# EasyEDA Pro project BLDC_DriverV4.eprj

# Schematic Schematic1_1
Create Date: 2024-09-20; Page Name: P1; Project Name: PCBPhase; Schematic Name: Schematic1; Update Date: 2024-09-20; Company: EasyEDA.com; Drawn: EasyEDA; Page Size: A4; Part Number: JLCPCB-002; Reviewed: EasyEDA; Version: V0.1
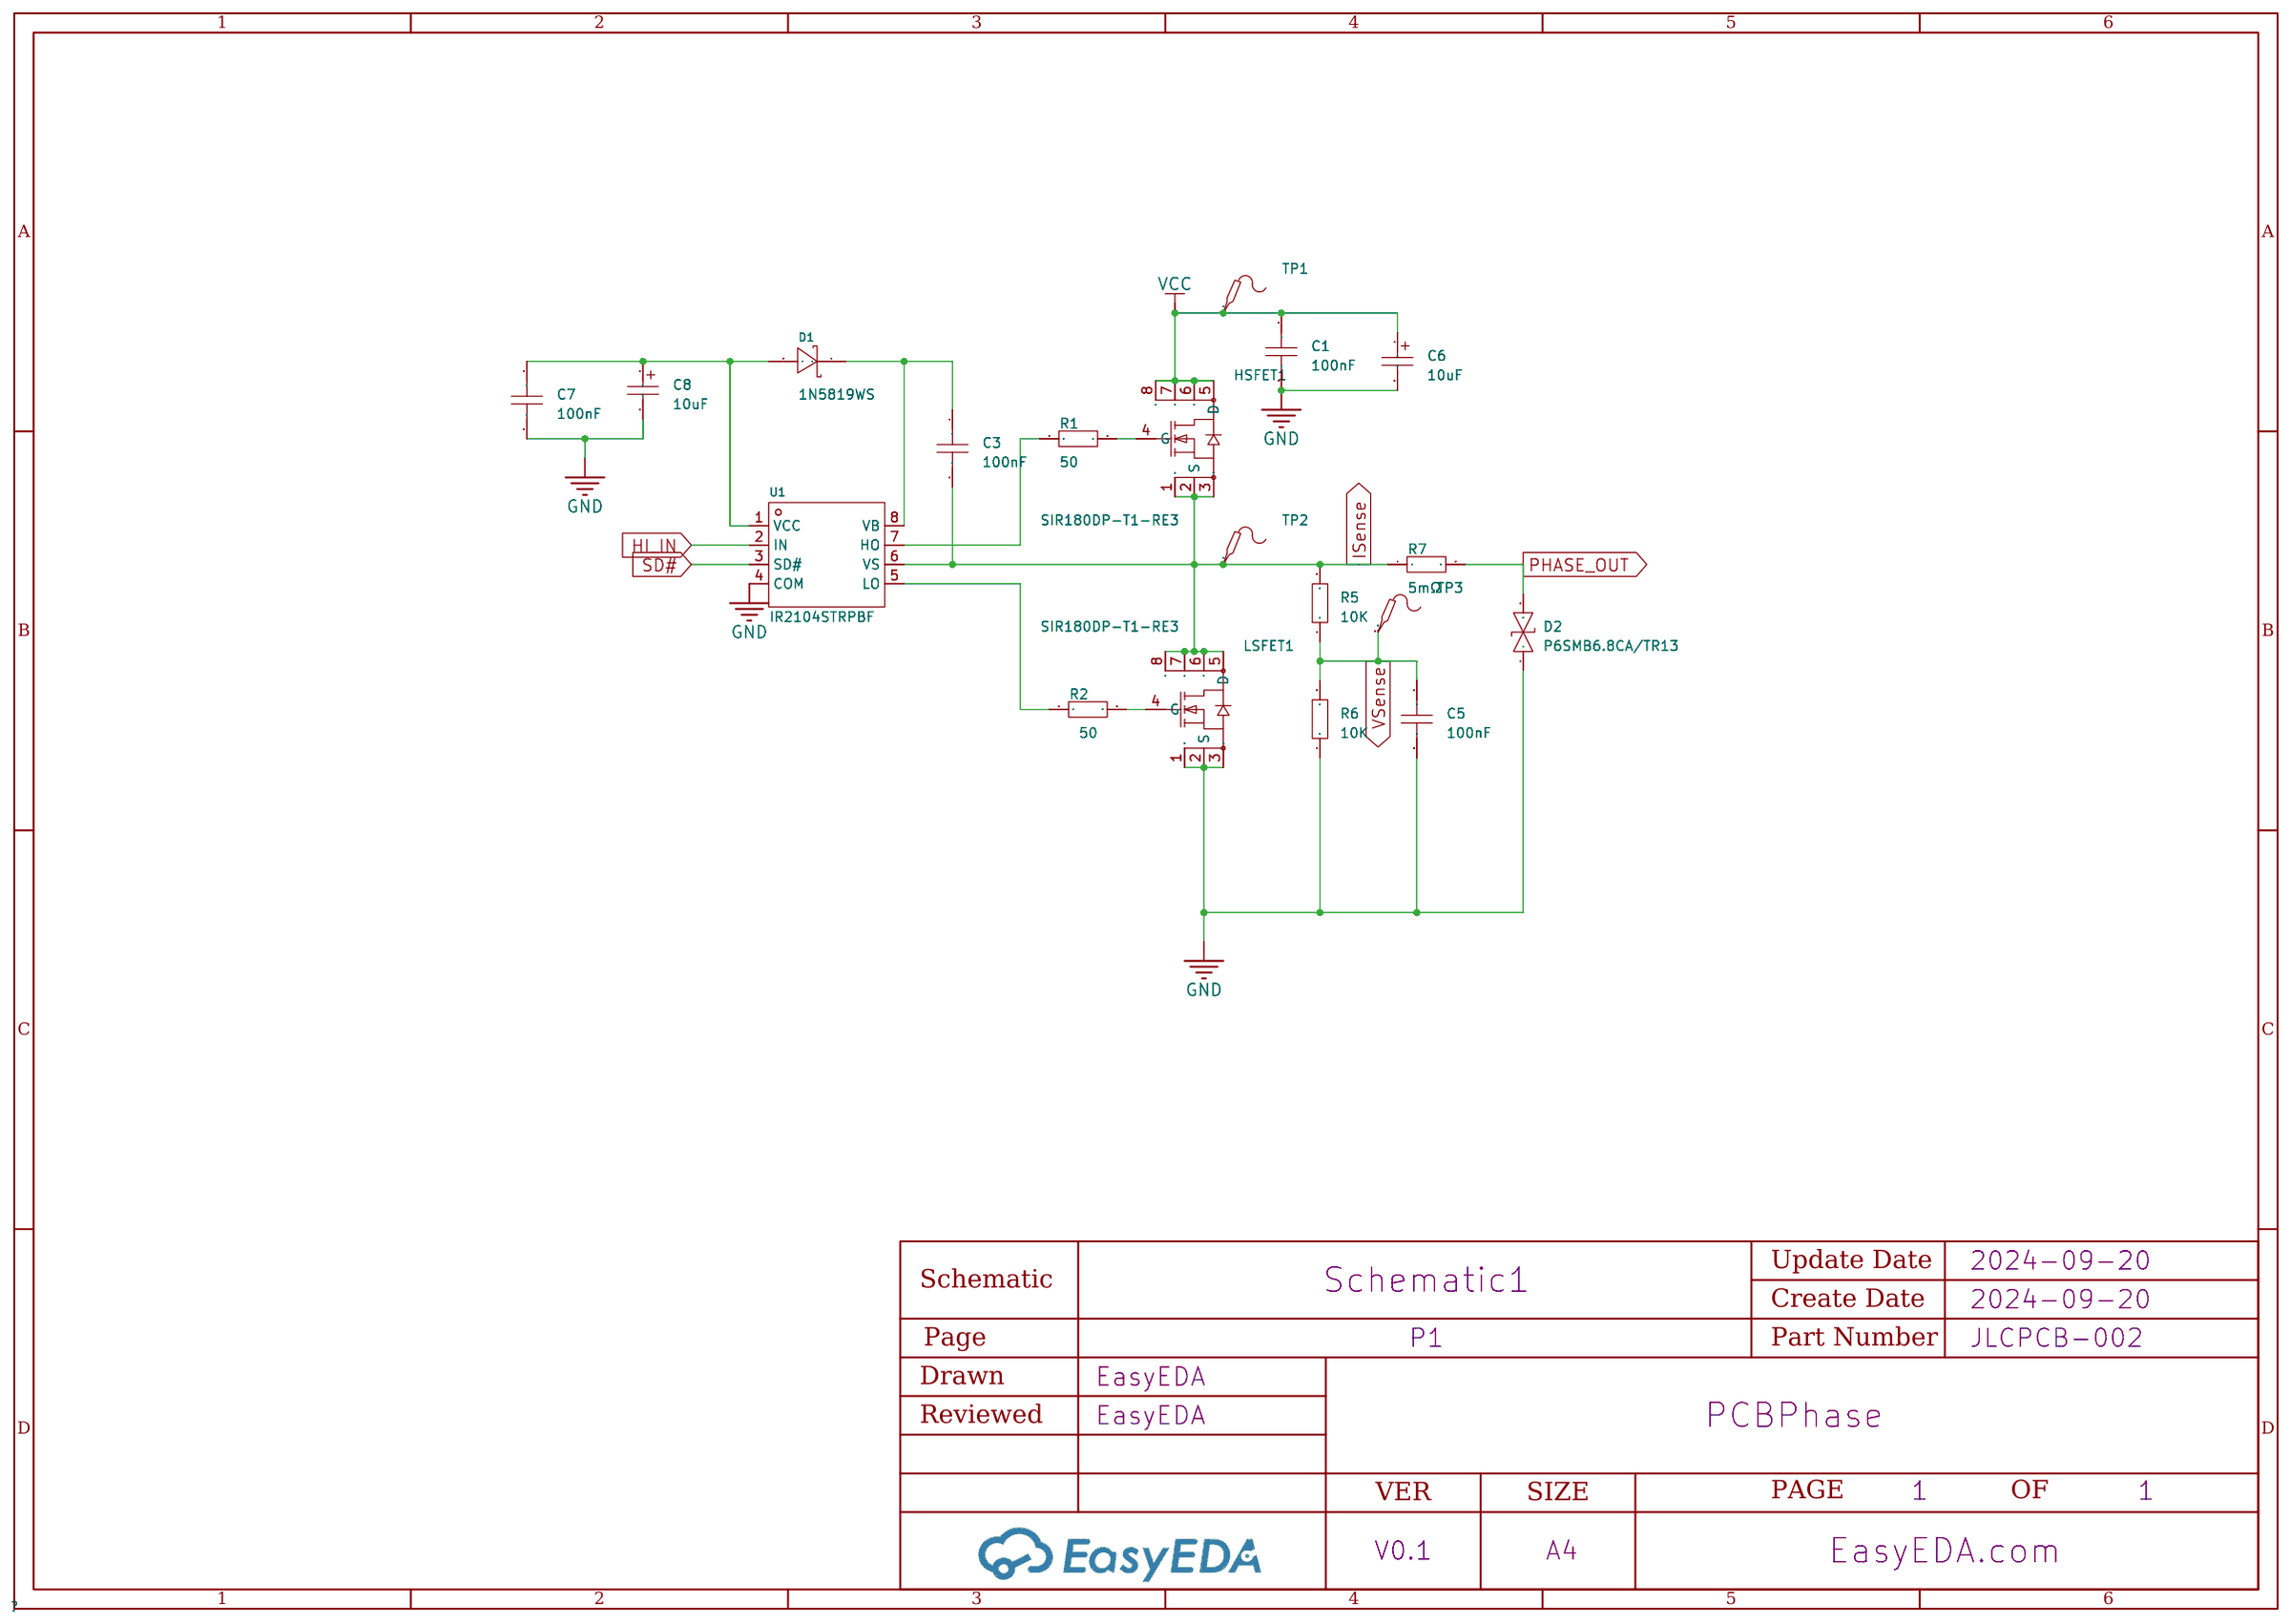
[diagram p0: schematic sheet]

## Parts
C1  100nF  [C0603]
C3  100nF  [C0603]
C5  100nF  [C0603]
C6  10uF  [CAP-SMD_BD3.0-L3.3-W3.3-RD]
C7  100nF  [C0603]
C8  10uF  [CAP-SMD_BD3.0-L3.3-W3.3-RD]
D1  1N5819WS  [SOD-323_L1.8-W1.3-LS2.5-RD]
D2  P6SMB6.8CA/TR13  [SMB_L4.6-W3.6-LS5.3-BI]
HSFET1  SIR180DP-T1-RE3  [POWERPAK-SO-8_L5.9-W4.9-P1.27-LS6.2-BL]
LSFET1  SIR180DP-T1-RE3  [POWERPAK-SO-8_L5.9-W4.9-P1.27-LS6.2-BL]
R1  50  [R0603]
R2  50  [R0603]
R5  10K  [R0603]
R6  10K  [R0603]
R7  5mΩ  [R2512]
TP1  -  [Test-Point-0.5mm]
TP2  -  [Test-Point-0.5mm]
TP3  -  [Test-Point-0.5mm]
U1  IR2104STRPBF  [SOIC-8_L4.9-W3.9-P1.27-LS6.0-BL]

## Library data of the parts
C1 C3 C5 C7 = CAP_0603: Supplier Footprint: 0603
C6 C8 = C_Ele_SMD_3x5.4mm: Supplier Footprint: SMD,3x5.4mm
D1 = 1N5819WS_C191023: Forward Voltage (Vf@If):600mV@1A Reverse Voltage (Vr):40V Average Rectified Current (Io):1A; LCSC Part Name: 电压:40V 电流:1A; Supplier Part: C191023; Manufacturer: Hottech(合科泰); Supplier Footprint: SOD-323; JLCPCB Part Class: Basic Part; Datasheet: https://atta.szlcsc.com/upload/public/pdf/source/20220428/3CB86FD8D28D653594B4E35F9D5AEFD9.pdf; Supplier: LCSC; Forward Voltage (Vf@If): 600mV@1A; Reverse Voltage (Vr): 40V; Average Rectified Current (Io): 1A
D2 = P6SMB6.8CA/TR13: Reverse Stand-Off Voltage (Vrwm):5.8V Maximum Clamping Voltage:10.5V Peak Pulse Current (Ipp)@10/1000us:58.1A Peak Pulse Power Dissipation (Ppp)@10/1000us:600W Breakdown Voltage:6.45V Type:TVS; Supplier Part: C78395; Manufacturer: Brightking(君耀电子); Supplier Footprint: SMB(DO-214AA); JLCPCB Part Class: Basic Part; Datasheet: https://atta.szlcsc.com/upload/public/pdf/source/20160709/1468031879762.pdf; Supplier: LCSC; Reverse Stand-Off Voltage (Vrwm): 5.8V; Maximum Clamping Voltage: 10.5V; Peak Pulse Current (Ipp)@10/1000us: 58.1A; Peak Pulse Power Dissipation (Ppp)@10/1000us: 600W; Breakdown Voltage: 6.45V; Type: TVS
HSFET1 LSFET1 = SIR180DP-T1-RE3: Type:1个NChannel Drain Source Voltage (Vdss):60V Continuous Drain Current (Id):；32.4A Power Dissipation (Pd):； Drain Source On Resistance (RDS(on)@Vgs,Id):2.05mΩ@10A,10V Gate Threshold Voltage (Vgs(th)@Id):3.6V@250uA Total Gate Charge (Qg@Vgs):87nC@10V Inp; LCSC Part Name: 1个N沟道 耐压:60V 电流:60A 电流:32.4A; Supplier Part: C5334421; Manufacturer: VISHAY(威世); Supplier Footprint: SO-8; JLCPCB Part Class: Extended Part; Datasheet: https://atta.szlcsc.com/upload/public/pdf/source/20221230/5EAF42ED79532020A551540FC13481A3.pdf; Supplier: LCSC; Type: 1个NChannel; Drain Source Voltage (Vdss): 60V; Continuous Drain Current (Id): ；32.4A; Power Dissipation (Pd): ；; Drain Source On Resistance (RDS(on)@Vgs,Id): 2.05mΩ@10A,10V; Gate Threshold Voltage (Vgs(th)@Id): 3.6V@250uA; Total Gate Charge (Qg@Vgs): 87nC@10V; Input Capacitance (Ciss@Vds): 4.03nF@30V; Operating Temperature: -55℃~+150℃@(Tj)
R1 R2 R5 R6 = Res_0603: Supplier Footprint: 0603
R7 = PA2512FKF7W0R005E: Type:Current Sensing Resistors Resistance: Tolerance:±1% Tolerance:±1% Power(Watts): Temperature Coefficient:±100ppm/℃ Temperature Coefficient:±100ppm/℃; LCSC Part Name: 5mΩ ±1% 2W; Supplier Part: C309526; Manufacturer: YAGEO(国巨); Supplier Footprint: 2512; JLCPCB Part Class: Extended Part; Datasheet: https://atta.szlcsc.com/upload/public/pdf/source/20190227/C375693_219964CC8B3EBD36DBDF701587FA5938.pdf; Supplier: LCSC; Type: Current Sensing Resistors; Tolerance: ±1%; Temperature Coefficient: ±100ppm/℃
TP1-TP3 = Test-Point: Test Point 测试点
U1 = IR2104STRPBF: Driven Configuration:Half Bridge Load Type:MOSFET；IGBT Number of Drivers:2 Peak Output Current(sink):360mA Peak Output Current(source):210mA Supply Voltage:10V~20V Supply Voltage:10V~20V Rise Time:100ns Fall Time:50ns Operating Temperature:-40℃~+150℃@(Tj); Supplier Part: C2960; Manufacturer: Infineon(英飞凌); Supplier Footprint: SOIC-8; JLCPCB Part Class: Extended Part; Datasheet: https://atta.szlcsc.com/upload/public/pdf/source/20140906/1457707236579.pdf; Supplier: LCSC; Driven Configuration: Half Bridge; Load Type: MOSFET；IGBT; Number of Drivers: 2; Peak Output Current(sink): 360mA; Peak Output Current(source): 210mA; Supply Voltage: 10V~20V; Rise Time: 100ns; Fall Time: 50ns; Operating Temperature: -40℃~+150℃@(Tj)

## Nets
GND: C1.2 C5.2 C6.2 C7.2 C8.2 D2.1 LSFET1.1(S) LSFET1.2(S) LSFET1.3(S) R6.1 U1.4(COM)
VCC: C1.1 C6.1 HSFET1.5(D) HSFET1.6(D) HSFET1.7(D) HSFET1.8(D) TP1.1
HI_IN: U1.2(IN)
ISense: C3.2 HSFET1.1(S) HSFET1.2(S) HSFET1.3(S) LSFET1.5(D) LSFET1.6(D) LSFET1.7(D) LSFET1.8(D) R5.2 R7.1 TP2.1 U1.6(VS)
PHASE_OUT: D2.2 R7.2
SD#: U1.3(SD#)
VSense: C5.1 R5.1 R6.2 TP3.1
$1N697: R1.1 U1.7(HO)
$1N698: HSFET1.4(G) R1.2
$1N699: R2.1 U1.5(LO)
$1N700: LSFET1.4(G) R2.2
$1N719: C3.1 D1.1(K) U1.8(VB)
$1N721: C7.1 C8.1 D1.2(A) U1.1(VCC)

# Schematic PCBPhase
Create Date: 2024-09-20; Page Name: P1; Project Name: PCBPhase; Schematic Name: PCBPhase; Update Date: 2024-09-19; Company: EasyEDA.com; Drawn: EasyEDA; Page Size: A4; Part Number: JLCPCB-002; Reviewed: EasyEDA; Version: V0.1
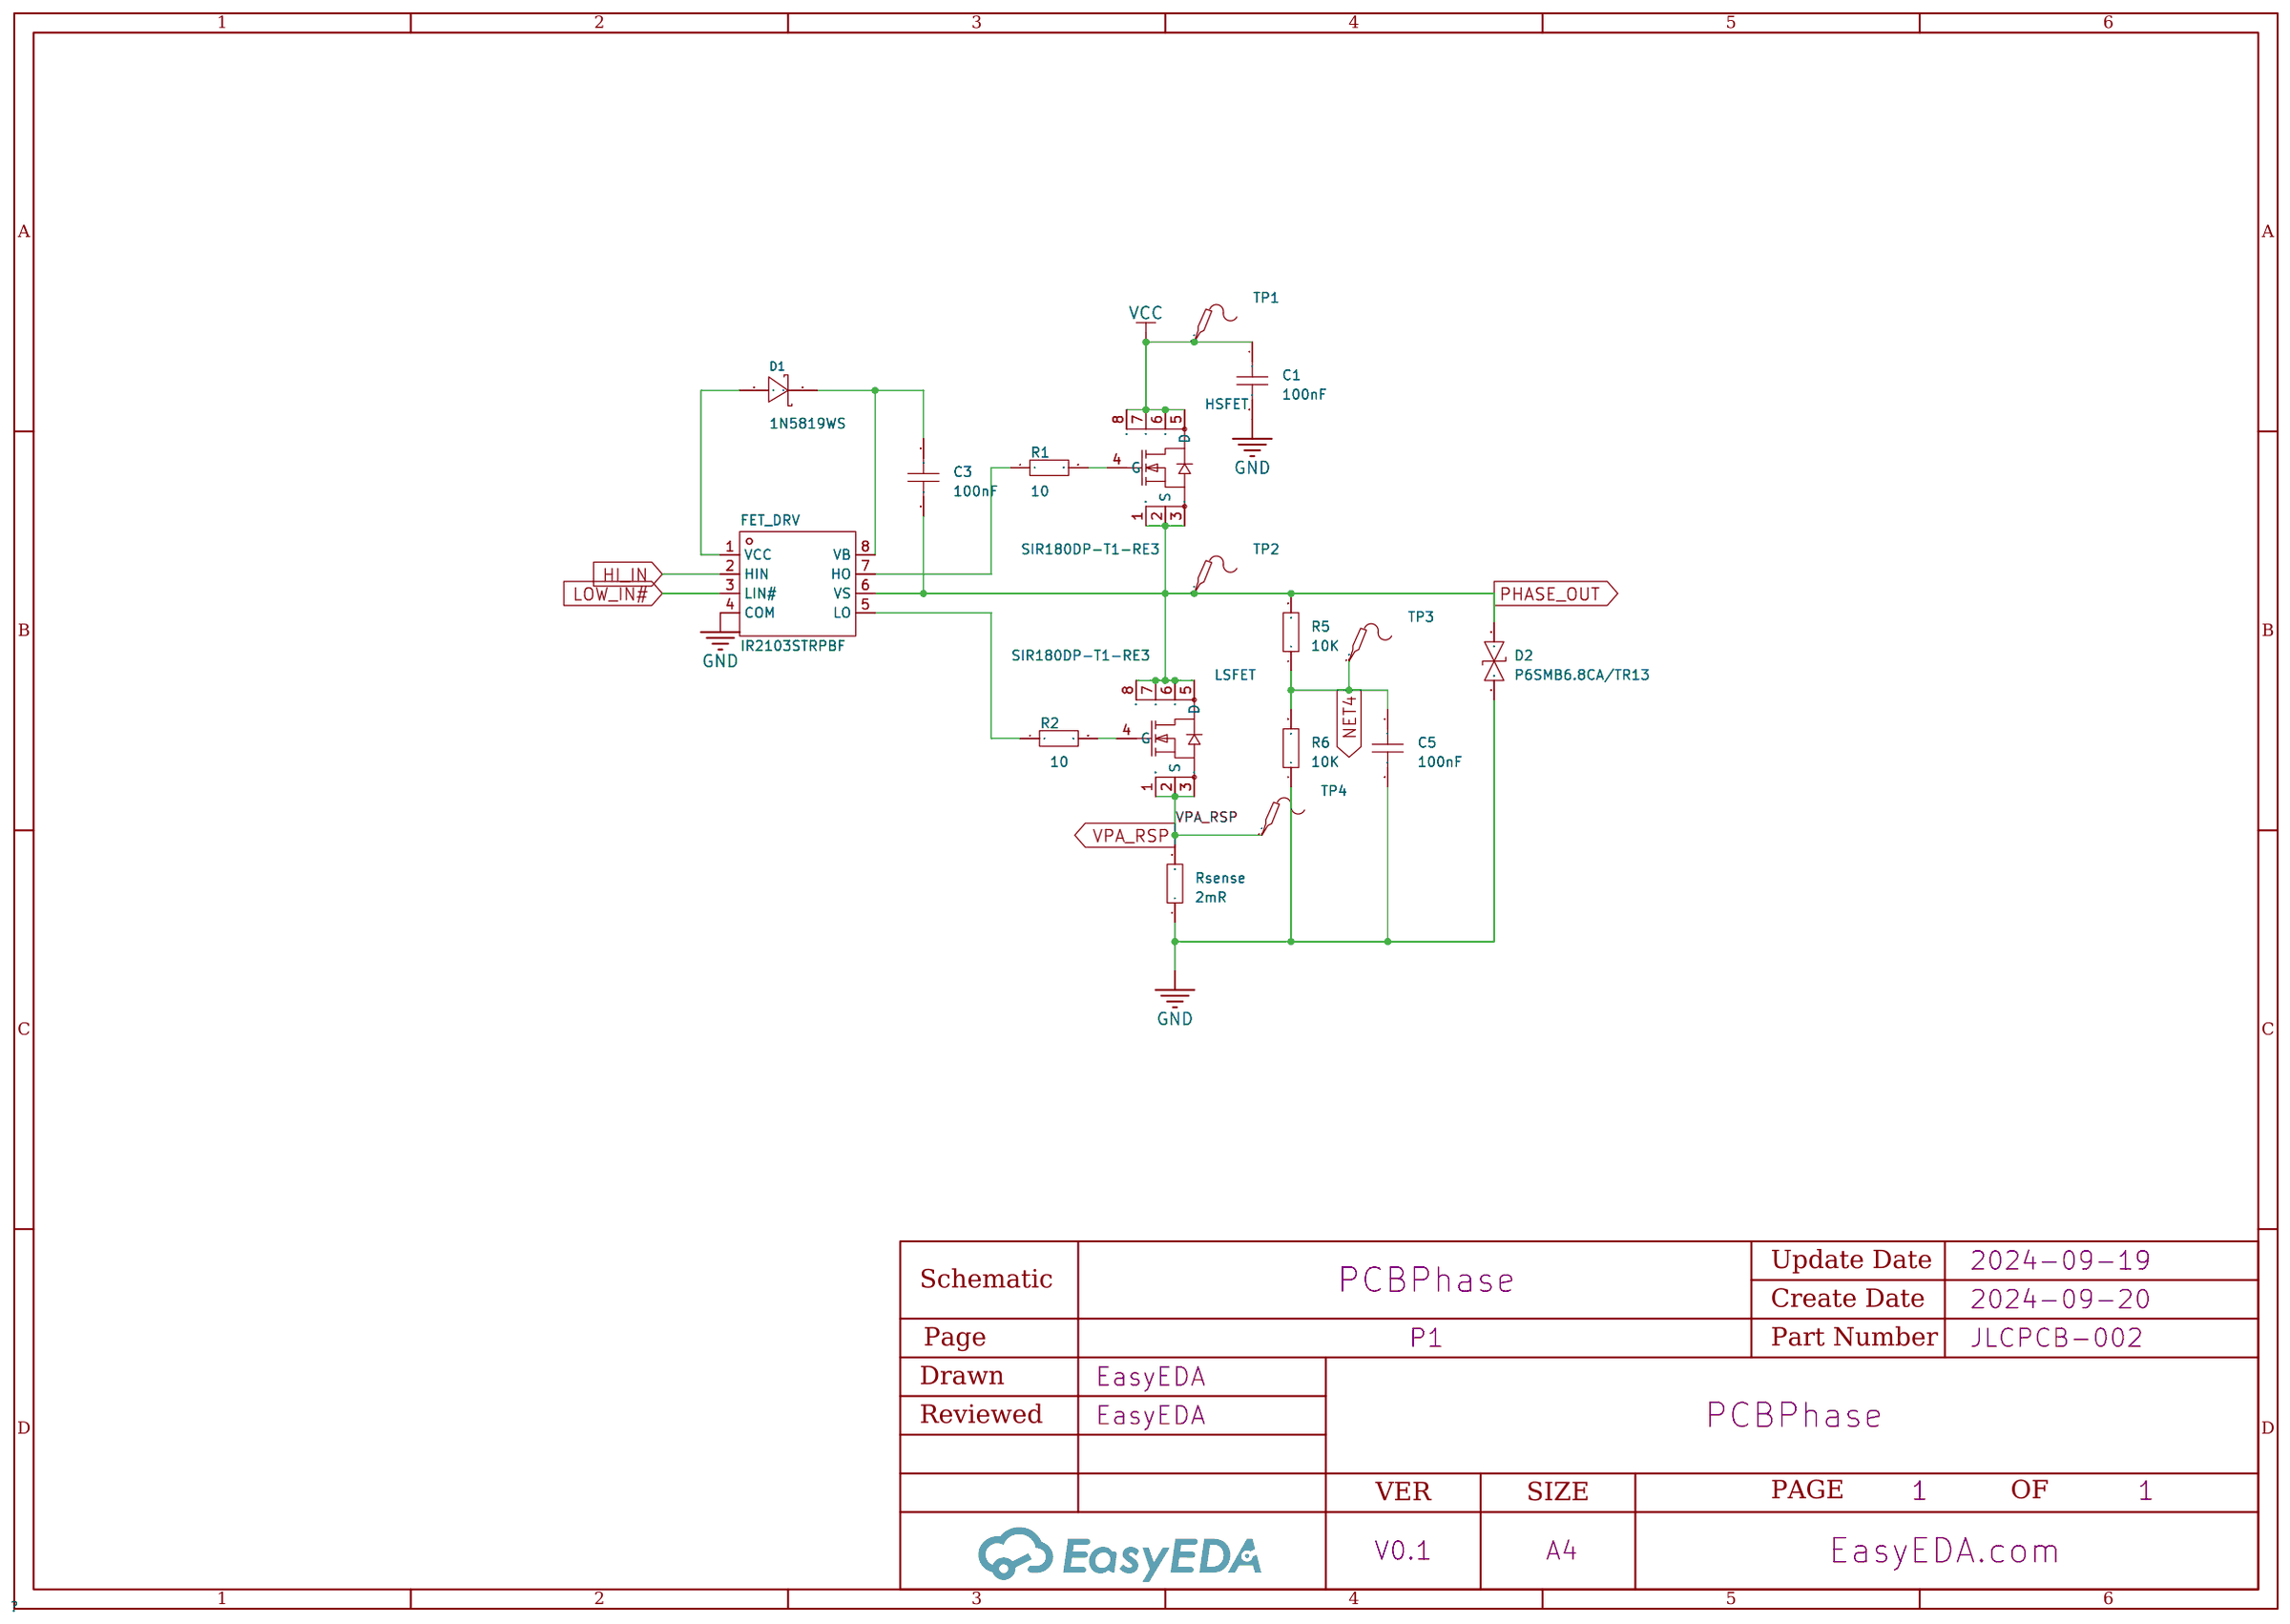
[diagram p1: schematic sheet]

## Parts
C1  100nF  [C0603]
C3  100nF  [C0603]
C5  100nF  [C0603]
D1  1N5819WS  [SOD-323_L1.8-W1.3-LS2.5-RD]
D2  P6SMB6.8CA/TR13  [SMB_L4.6-W3.6-LS5.3-BI]
FET_DRV  IR2103STRPBF  [SOIC-8_L4.9-W3.9-P1.27-LS6.0-BL]
HSFET  SIR180DP-T1-RE3  [POWERPAK-SO-8_L5.9-W4.9-P1.27-LS6.2-BL]
LSFET  SIR180DP-T1-RE3  [POWERPAK-SO-8_L5.9-W4.9-P1.27-LS6.2-BL]
R1  10  [R0603]
R2  10  [R0603]
R5  10K  [R0603]
R6  10K  [R0603]
Rsense  2mR  [R0603]
TP1  -  [Test-Point-0.5mm]
TP2  -  [Test-Point-0.5mm]
TP3  -  [Test-Point-0.5mm]
TP4  -  [Test-Point-0.5mm]

## Library data of the parts
C1 C3 C5 = CAP_0603: Supplier Footprint: 0603
D1 = 1N5819WS_C191023: Forward Voltage (Vf@If):600mV@1A Reverse Voltage (Vr):40V Average Rectified Current (Io):1A; LCSC Part Name: 电压:40V 电流:1A; Supplier Part: C191023; Manufacturer: Hottech(合科泰); Supplier Footprint: SOD-323; JLCPCB Part Class: Basic Part; Datasheet: https://atta.szlcsc.com/upload/public/pdf/source/20220428/3CB86FD8D28D653594B4E35F9D5AEFD9.pdf; Supplier: LCSC; Forward Voltage (Vf@If): 600mV@1A; Reverse Voltage (Vr): 40V; Average Rectified Current (Io): 1A
D2 = P6SMB6.8CA/TR13: Reverse Stand-Off Voltage (Vrwm):5.8V Maximum Clamping Voltage:10.5V Peak Pulse Current (Ipp)@10/1000us:58.1A Peak Pulse Power Dissipation (Ppp)@10/1000us:600W Breakdown Voltage:6.45V Type:TVS; Supplier Part: C78395; Manufacturer: Brightking(君耀电子); Supplier Footprint: SMB(DO-214AA); JLCPCB Part Class: Basic Part; Datasheet: https://atta.szlcsc.com/upload/public/pdf/source/20160709/1468031879762.pdf; Supplier: LCSC; Reverse Stand-Off Voltage (Vrwm): 5.8V; Maximum Clamping Voltage: 10.5V; Peak Pulse Current (Ipp)@10/1000us: 58.1A; Peak Pulse Power Dissipation (Ppp)@10/1000us: 600W; Breakdown Voltage: 6.45V; Type: TVS
FET_DRV = IR2103STRPBF: Driven Configuration:Half Bridge Load Type:MOSFET；IGBT Number of Drivers:2 Peak Output Current(sink):360mA Peak Output Current(source):210mA Supply Voltage:10V~20V Supply Voltage:10V~20V Rise Time:100ns Fall Time:50ns Operating Temperature:-40℃~+150℃@(Tj); Supplier Part: C2957; Manufacturer: Infineon(英飞凌); Supplier Footprint: SOIC-8; JLCPCB Part Class: Extended Part; Datasheet: https://atta.szlcsc.com/upload/public/pdf/source/20140228/1457706997637.pdf; Supplier: LCSC; Driven Configuration: Half Bridge; Load Type: MOSFET；IGBT; Number of Drivers: 2; Peak Output Current(sink): 360mA; Peak Output Current(source): 210mA; Supply Voltage: 10V~20V; Rise Time: 100ns; Fall Time: 50ns; Operating Temperature: -40℃~+150℃@(Tj)
HSFET LSFET = SIR180DP-T1-RE3: Type:1个NChannel Drain Source Voltage (Vdss):60V Continuous Drain Current (Id):；32.4A Power Dissipation (Pd):； Drain Source On Resistance (RDS(on)@Vgs,Id):2.05mΩ@10A,10V Gate Threshold Voltage (Vgs(th)@Id):3.6V@250uA Total Gate Charge (Qg@Vgs):87nC@10V Inp; LCSC Part Name: 1个N沟道 耐压:60V 电流:60A 电流:32.4A; Supplier Part: C5334421; Manufacturer: VISHAY(威世); Supplier Footprint: SO-8; JLCPCB Part Class: Extended Part; Datasheet: https://atta.szlcsc.com/upload/public/pdf/source/20221230/5EAF42ED79532020A551540FC13481A3.pdf; Supplier: LCSC; Type: 1个NChannel; Drain Source Voltage (Vdss): 60V; Continuous Drain Current (Id): ；32.4A; Power Dissipation (Pd): ；; Drain Source On Resistance (RDS(on)@Vgs,Id): 2.05mΩ@10A,10V; Gate Threshold Voltage (Vgs(th)@Id): 3.6V@250uA; Total Gate Charge (Qg@Vgs): 87nC@10V; Input Capacitance (Ciss@Vds): 4.03nF@30V; Operating Temperature: -55℃~+150℃@(Tj)
R1 R2 R5 R6 Rsense = Res_0603: Supplier Footprint: 0603
TP1-TP4 = Test-Point: Test Point 测试点

## Nets
GND: C1.2 C5.2 D2.1 FET_DRV.4(COM) R6.1 Rsense.1
VCC: C1.1 HSFET.5(D) HSFET.6(D) HSFET.7(D) HSFET.8(D) TP1.1
HI_IN: FET_DRV.2(HIN)
LOW_IN#: FET_DRV.3(LIN#)
NET4: C5.1 R5.1 R6.2 TP3.1
PHASE_OUT: C3.2 D2.2 FET_DRV.6(VS) HSFET.1(S) HSFET.2(S) HSFET.3(S) LSFET.5(D) LSFET.6(D) LSFET.7(D) LSFET.8(D) R5.2 TP2.1
VPA_RSP: LSFET.1(S) LSFET.2(S) LSFET.3(S) Rsense.2 TP4.1
$1N508: FET_DRV.7(HO) R1.1
$1N509: HSFET.4(G) R1.2
$1N510: FET_DRV.5(LO) R2.1
$1N511: LSFET.4(G) R2.2
$1N519: D1.2(A) FET_DRV.1(VCC)
$1N521: C3.1 D1.1(K) FET_DRV.8(VB)

# Board PCB1
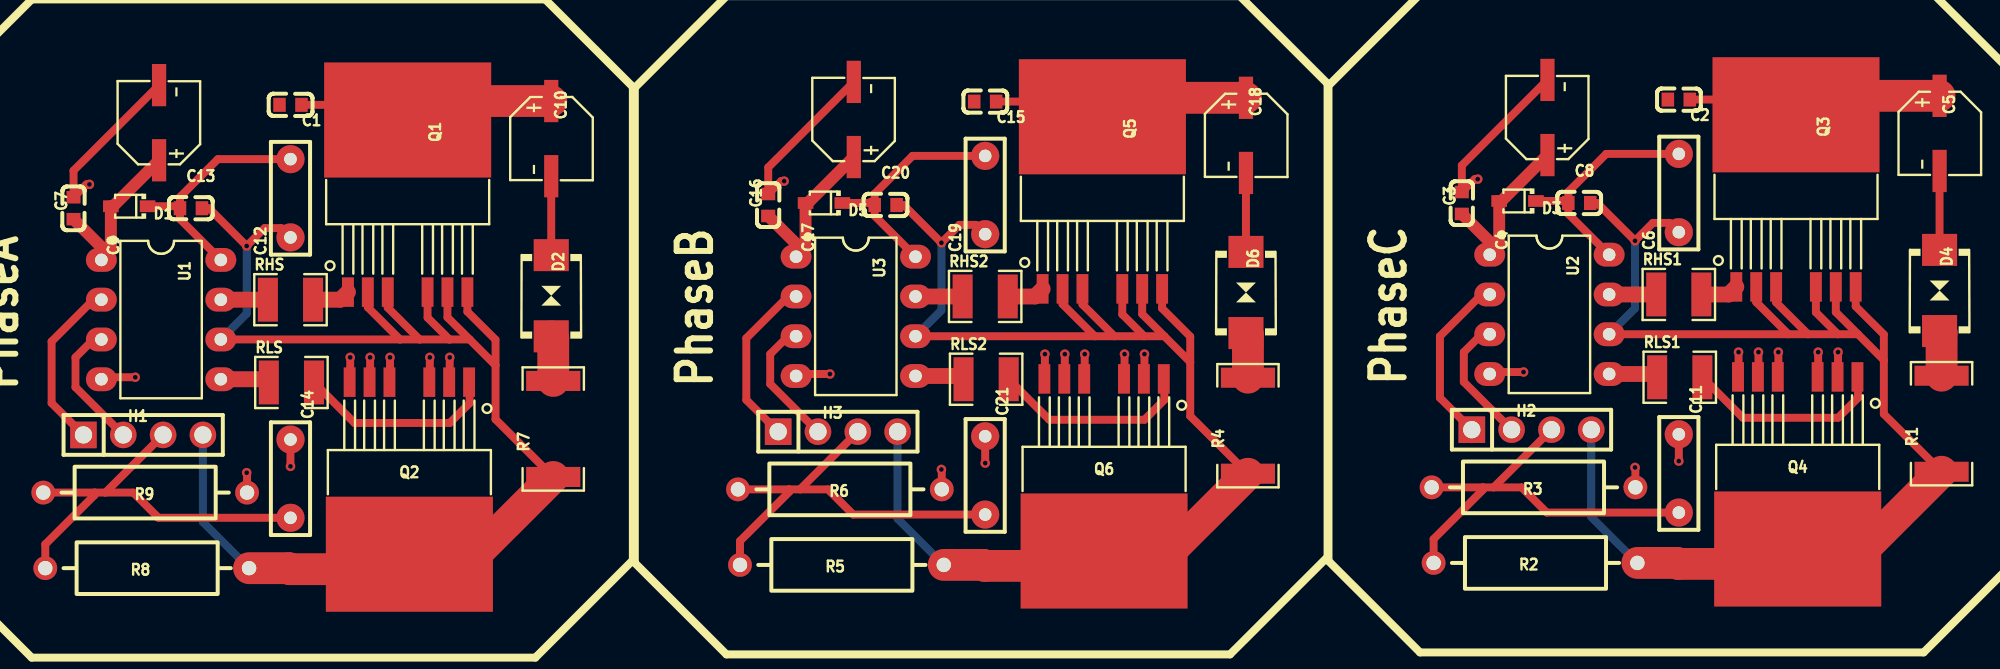
[diagram p2: board, top side]
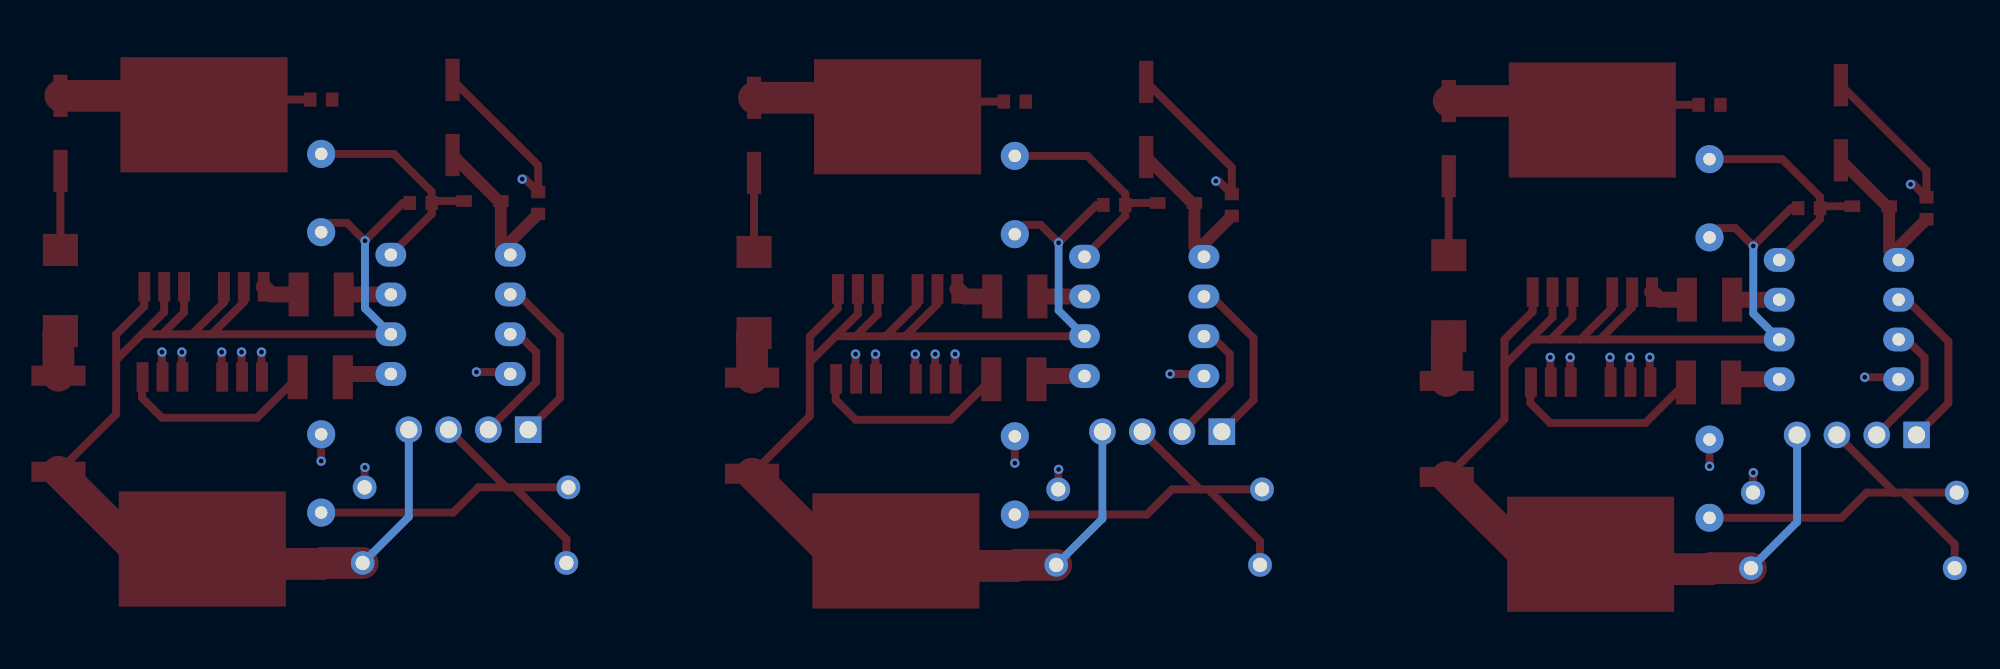
[diagram p3: board, bottom side, seen from below]

No outline. copper layers: Top Layer, Bottom Layer. Coordinates in mm from the lowest, leftmost part position.
Stack: Top Layer 0.035mm / Dielectric1 1.51mm FR4 er 4.5 / Bottom Layer 0.035mm

## Design rules (mm)
template: JLCPCB Capability(Two Layers Board)
spacing copperThickness1oz (default): track to track 0.102, other pairs 0.152 to 0.3
spacing copperThickness2oz: track to track 0.203, other pairs 0.152 to 0.3
track width copperThickness1oz (default): min 0.127, default 0.254, max 2.54
track width copperThickness2oz: min 0.203, default 0.254, max 2.54
differential pair differentialPair (default): width min 0.127, default 0.254, max 2.54; gap min 0.152, default 0.152
via viaSize (default): diameter min 0.5, default 0.61, max 10; hole min 0.3, default 0.305, max 6.3

## Placement (name value [footprint] x y rotation side)
C1  100nF  [C0603]  13.84 29.59 180 top
C2  100nF  [C0603]  102.42 29.92 180 top
C3  100nF  [C0603]  88.58 23.32 90 top
C4  10uF  [CAP-SMD_BD5.0-L5.3-W5.3-LS6.3-FD]  94.04 28.78 90 top
C5  10uF  [CAP-SMD_BD5.0-L5.3-W5.3-LS6.3-FD]  119.06 27.77 270 top
C6  1uF  [CAP-TH_L7.2-W2.5-P5.00-D0.6]  102.42 23.96 90 top
C7  100nF  [C0603]  0 22.99 90 top
C8  100nF  [C0603]  96.07 23.32 0 top
C9  10uF  [CAP-SMD_BD5.0-L5.3-W5.3-LS6.3-FD]  5.46 28.45 90 top
C10  10uF  [CAP-SMD_BD5.0-L5.3-W5.3-LS6.3-FD]  30.48 27.43 270 top
C11  1uF  [CAP-TH_L7.2-W2.5-P5.00-D0.6]  102.42 6.05 270 top
C12  1uF  [CAP-TH_L7.2-W2.5-P5.00-D0.6]  13.84 23.62 90 top
C13  100nF  [C0603]  7.49 22.99 0 top
C14  1uF  [CAP-TH_L7.2-W2.5-P5.00-D0.6]  13.84 5.72 270 top
C15  100nF  [C0603]  58.17 29.8 180 top
C16  100nF  [C0603]  44.32 23.19 90 top
C17  10uF  [CAP-SMD_BD5.0-L5.3-W5.3-LS6.3-FD]  49.78 28.65 90 top
C18  10uF  [CAP-SMD_BD5.0-L5.3-W5.3-LS6.3-FD]  74.8 27.64 270 top
C19  1uF  [CAP-TH_L7.2-W2.5-P5.00-D0.6]  58.17 23.83 90 top
C20  100nF  [C0603]  51.82 23.19 0 top
C21  1uF  [CAP-TH_L7.2-W2.5-P5.00-D0.6]  58.17 5.92 270 top
D1  1N5819WS  [SOD-323_L1.8-W1.3-LS2.5-RD]  3.56 23.11 180 top
D2  P6SMB6.8CA/TR13  [SMB_L4.6-W3.6-LS5.3-BI]  30.48 17.4 270 top
D3  1N5819WS  [SOD-323_L1.8-W1.3-LS2.5-RD]  92.13 23.45 180 top
D4  P6SMB6.8CA/TR13  [SMB_L4.6-W3.6-LS5.3-BI]  119.06 17.73 270 top
D5  1N5819WS  [SOD-323_L1.8-W1.3-LS2.5-RD]  47.88 23.32 180 top
D6  P6SMB6.8CA/TR13  [SMB_L4.6-W3.6-LS5.3-BI]  74.8 17.61 270 top
H1  -  [HDR-TH_4P-P2.54-V-M]  4.44 8.51 0 top
H2  -  [HDR-TH_4P-P2.54-V-M]  93.02 8.84 0 top
H3  -  [HDR-TH_4P-P2.54-V-M]  48.77 8.72 0 top
Q1  IRF2804STRL7PP  [D2PAK-7_L10.6-W9.6-P1.27-LS15.9-BR]  21.32 23.12 270 top
Q2  IRF2804STRL7PP  [D2PAK-7_L10.6-W9.6-P1.27-LS15.9-BR]  21.43 6.38 90 top
Q3  IRF2804STRL7PP  [D2PAK-7_L10.6-W9.6-P1.27-LS15.9-BR]  109.9 23.46 270 top
Q4  IRF2804STRL7PP  [D2PAK-7_L10.6-W9.6-P1.27-LS15.9-BR]  110.01 6.72 90 top
Q5  IRF2804STRL7PP  [D2PAK-7_L10.6-W9.6-P1.27-LS15.9-BR]  65.64 23.33 270 top
Q6  IRF2804STRL7PP  [D2PAK-7_L10.6-W9.6-P1.27-LS15.9-BR]  65.75 6.59 90 top
R1  5mΩ  [R2512]  119.18 9.22 90 top
R2  10kΩ  [RES-TH_BD3.3-L9.0-P13.00-D0.6]  93.28 0.33 0 top
R3  10kΩ  [RES-TH_BD3.3-L9.0-P13.00-D0.6]  93.15 5.16 180 top
R4  5mΩ  [R2512]  74.93 9.1 90 top
R5  10kΩ  [RES-TH_BD3.3-L9.0-P13.00-D0.6]  49.02 0.21 0 top
R6  10kΩ  [RES-TH_BD3.3-L9.0-P13.00-D0.6]  48.89 5.03 180 top
R7  5mΩ  [R2512]  30.61 8.89 90 top
R8  10kΩ  [RES-TH_BD3.3-L9.0-P13.00-D0.6]  4.7 0 0 top
R9  10kΩ  [RES-TH_BD3.3-L9.0-P13.00-D0.6]  4.57 4.83 180 top
RHS  10  [R1210]  13.84 17.14 0 top
RHS1  10  [R1210]  102.42 17.48 0 top
RHS2  10  [R1210]  58.17 17.35 0 top
RLS  10  [R1210]  13.9 11.86 0 top
RLS1  10  [R1210]  102.48 12.19 0 top
RLS2  10  [R1210]  58.23 12.06 0 top
U1  IR2104PBF  [DIP-8_L9.9-W6.6-P2.54-LS7.62-BL]  5.59 15.88 270 top
U2  IR2104PBF  [DIP-8_L9.9-W6.6-P2.54-LS7.62-BL]  94.16 16.21 270 top
U3  IR2104PBF  [DIP-8_L9.9-W6.6-P2.54-LS7.62-BL]  49.91 16.08 270 top

## Footprints (pads in the part's own frame, mm; a bottom-side part is the same pattern mirrored in y, then rotated)
C0603
  rect 0.8x0.9 smd: 1(-0.7,0) 2(0.7,0)
CAP-SMD_BD5.0-L5.3-W5.3-LS6.3-FD
  rect 2.7x0.91 smd: 1(-2.4,0) 2(2.4,0)
CAP-TH_L7.2-W2.5-P5.00-D0.6
  round 1.8 hole 0.8: 1(-2.499,0) 2(2.499,0)
D2PAK-7_L10.6-W9.6-P1.27-LS15.9-BR
  rect 1.887x0.762 smd: 1(5.495,-3.81) 2(5.495,-2.54) 3(5.495,-1.27) 5(5.495,1.27) 6(5.495,2.54) 7(5.495,3.81)
  rect 7.356x10.66 smd: 4(-5.495,0)
DIP-8_L9.9-W6.6-P2.54-LS7.62-BL
  oval 1.524x1.97 hole 0.8: 1(-3.81,-3.81) 2(-1.27,-3.81) 3(1.27,-3.81) 4(3.81,-3.81) 5(3.81,3.81) 6(1.27,3.81) 7(-1.27,3.81) 8(-3.81,3.81)
HDR-TH_4P-P2.54-V-M
  rect 1.7x1.7 hole 1.1: 1(-3.81,0)
  round 1.7 hole 1.1: 2(-1.27,0) 3(1.27,0) 4(3.81,0)
R1210
  rect 1.282x2.808 smd: 1(-1.441,0) 2(1.441,0)
R2512
  rect 1.282x3.456 smd: 1(-3.067,0) 2(3.067,0)
RES-TH_BD3.3-L9.0-P13.00-D0.6
  round 1.524 hole 0.914: 1(-6.5,0) 2(6.5,0)
SMB_L4.6-W3.6-LS5.3-BI
  rect 2.047x2.241 smd: 1(-2.591,0) 2(2.591,0)
SOD-323_L1.8-W1.3-LS2.5-RD
  rect 1x0.75 smd: 1(-1.173,0) 2(1.173,0)

## Nets
GND: C1.2 C2.2 C3.2 C4.2 C5.2 C7.2 C9.2 C10.2 C11.1 C14.1 C15.2 C16.2 C17.2 C18.2 C21.1 D2.1 D4.1 D6.1 Q2.2 Q2.3 Q2.5 Q2.6 Q2.7 Q4.2 Q4.3 Q4.5 Q4.6 Q4.7 Q6.2 Q6.3 Q6.5 Q6.6 Q6.7 R3.1 R6.1 R9.1 U1.4 U2.4 U3.4
VCC: C1.1 C2.1 C5.1 C10.1 C15.1 C18.1 Q1.4 Q3.4 Q5.4
$1I136R1/HI_IN: H1.1 U1.2
$1I136R1/PHASE_OUT: D2.2 R7.2
$1I136R1/SD#: H1.2 U1.3
$1I136R1/VSENSE: C14.2 H1.3 R8.1 R9.2
$1I136R2/HI_IN: H2.1 U2.2
$1I136R2/PHASE_OUT: D4.2 R1.2
$1I136R2/SD#: H2.2 U2.3
$1I136R2/VSENSE: C11.2 H2.3 R2.1 R3.2
$1I136R3/HI_IN: H3.1 U3.2
$1I136R3/PHASE_OUT: D6.2 R4.2
$1I136R3/SD#: H3.2 U3.3
$1I136R3/VSENSE: C21.2 H3.3 R5.1 R6.2
NET5: C12.1 C13.2 H1.4 Q1.2 Q1.3 Q1.5 Q1.6 Q1.7 Q2.4 R7.1 R8.2 U1.6
NET5R2: C6.1 C8.2 H2.4 Q3.2 Q3.3 Q3.5 Q3.6 Q3.7 Q4.4 R1.1 R2.2 U2.6
NET5R3: C19.1 C20.2 H3.4 Q5.2 Q5.3 Q5.5 Q5.6 Q5.7 Q6.4 R4.1 R5.2 U3.6
$1I136R1/$1N697: RHS.1 U1.7
$1I136R1/$1N698: Q1.1 RHS.2
$1I136R1/$1N699: RLS.1 U1.5
$1I136R1/$1N700: Q2.1 RLS.2
$1I136R1/$1N2292: C7.1 C9.1 D1.2 U1.1
$1I136R1/$1N2600: C12.2 C13.1 D1.1 U1.8
$1I136R2/$1N697: RHS1.1 U2.7
$1I136R2/$1N698: Q3.1 RHS1.2
$1I136R2/$1N699: RLS1.1 U2.5
$1I136R2/$1N700: Q4.1 RLS1.2
$1I136R2/$1N2292: C3.1 C4.1 D3.2 U2.1
$1I136R2/$1N2600: C6.2 C8.1 D3.1 U2.8
$1I136R3/$1N697: RHS2.1 U3.7
$1I136R3/$1N698: Q5.1 RHS2.2
$1I136R3/$1N699: RLS2.1 U3.5
$1I136R3/$1N700: Q6.1 RLS2.2
$1I136R3/$1N2292: C16.1 C17.1 D5.2 U3.1
$1I136R3/$1N2600: C19.2 C20.1 D5.1 U3.8

## Via types
v1: diameter 0.61, hole 0.305, Top Layer to Bottom Layer, 30 vias

## Routing (per net, layer and track width the routed paths; a pad name or vN(x,y) marks a point on that pad's centre or on a via; arc(x,y) is an arc through that point)
GND: length 87
  Top Layer w0.508: v1(55.37,6.3) 55.39,6.28 R6.1 ; Q6.2 68.33,12.12 v1(68.33,13.67) ; R9.1 11.07,6.07 v1(11.05,6.1) ; Q4.3 111.31,12.25 v1(111.31,13.8) ; U2.4 90.48,12.53 v1(92.51,12.53) ; v1(64.52,13.67) 64.52,12.12 Q6.5 ; Q4.7 106.23,12.25 v1(106.23,13.8) ; v1(20.19,13.46) 20.19,11.91 Q2.5 ; U1.4 1.91,12.19 v1(3.94,12.19) ; C9.2 0,25.39 C7.2 0.82,24.51 v1(1.02,24.51) ; D2.1 C10.2 ; v1(67.06,13.67) 67.06,12.12 Q6.3 ; v1(99.63,6.43) 99.65,6.41 R3.1 ; v1(107.5,13.8) 107.5,12.25 Q4.6 ; v1(61.98,13.67) 61.98,12.12 Q6.7 ; Q2.7 17.65,11.91 v1(17.65,13.46) ; Q4.5 108.77,12.25 v1(108.77,13.8) ; Q2.6 18.92,11.91 v1(18.92,13.46) ; v1(48.26,12.4) 46.23,12.4 U3.4 ; D4.1 C5.2 ; v1(89.59,24.84) 89.4,24.84 88.58,24.02 88.58,25.72 C4.2 ; v1(102.42,6.84) C11.1 ; v1(22.73,13.46) 22.73,11.91 Q2.3 ; v1(13.84,6.5) C14.1 ; v1(45.34,24.72) 45.15,24.72 C16.2 44.32,25.59 C17.2 ; v1(63.25,13.67) 63.25,12.12 Q6.6 ; Q2.2 24,11.91 v1(24,13.46) ; v1(112.58,13.8) 112.58,12.25 Q4.2 ; D6.1 C18.2 ; v1(58.17,6.71) C21.1
VCC: length 50.5
  Top Layer w0.508: C15.1 64.67,29.8 Q5.4 ; Q3.4 108.93,29.92 C2.1 ; Q1.4 20.35,29.59 C1.1
  Top Layer w2.032: Q5.4 66.85,30.04 C18.1 ; C10.1 22.53,29.83 Q1.4 ; C5.1 111.11,30.17 Q3.4
$1I42/ISENSE: length 69.6
  Top Layer w0.508: 18.78,17.63 18.78,16.66 20.83,14.6 ; 25.27,14.6 26.92,12.95 ; 25.27,14.6 23.86,16.02 23.86,17.63 ; 25.27,14.6 23.99,14.6 ; 26.92,12.95 26.92,9.51 30.61,5.82 30.61,6.33 ; 26.92,12.95 26.92,14.59 25.13,16.38 25.13,17.63 ; 23.99,14.6 22.59,16 22.59,17.63 ; 23.99,14.6 22.08,14.6 ; 22.08,14.6 20.83,14.6 ; 22.08,14.6 20.05,16.64 20.05,17.63 ; 20.83,14.6 9.4,14.6
  Top Layer w2.032: 30.61,5.82 25.67,0.89 21.43,0.89 20.48,-0.06 13.8,-0.06 13.74,0 11.2,0
$1I136R1/HI_IN: length 11.1
  Top Layer w0.508: H1.1 -1.4,10.54 -1.4,14.48 1.27,17.14 1.78,17.14
$1I136R1/PHASE_OUT: length 2.9
  Top Layer w2.032: R7.2 30.61,14.68 D2.2
$1I136R1/SD#: length 8.3
  Top Layer w0.508: U1.3 1.27,14.6 0.13,13.46 0.13,11.56 H1.2
$1I136R1/VSENSE: length 27.3
  Top Layer w0.508: C14.2 5.42,3.22 3.81,4.83 2.03,4.83 ; R9.2 1.34,4.83 ; 1.34,4.83 1.34,4.66 -1.8,1.52 -1.8,0.51 ; 1.34,4.83 2.03,4.83 ; 2.03,4.83 H1.3
$1I136R2/HI_IN: length 11.1
  Top Layer w0.508: U2.2 89.85,17.48 87.18,14.81 87.18,10.88 H2.1
$1I136R2/PHASE_OUT: length 2.9
  Top Layer w2.032: R1.2 119.18,15.01 D4.2
$1I136R2/SD#: length 8.3
  Top Layer w0.508: U2.3 89.85,14.94 88.7,13.8 88.7,11.89 H2.2
$1I136R2/VSENSE: length 27.3
  Top Layer w0.508: 90.61,5.16 92.39,5.16 94,3.55 C11.2 ; 90.61,5.16 89.92,5.16 ; 90.61,5.16 H2.3 ; 86.78,0.84 86.78,1.86 89.92,5 89.92,5.16 ; R3.2 89.92,5.16
$1I136R3/HI_IN: length 11.1
  Top Layer w0.508: H3.1 42.93,10.75 42.93,14.69 45.59,17.35 U3.2
$1I136R3/PHASE_OUT: length 2.9
  Top Layer w2.032: D6.2 74.93,14.89 R4.2
$1I136R3/SD#: length 8.3
  Top Layer w0.508: H3.2 44.45,11.76 44.45,13.67 45.59,14.81 U3.3
$1I136R3/VSENSE: length 27.3
  Top Layer w0.508: 46.35,5.03 48.13,5.03 49.74,3.42 C21.2 ; 46.35,5.03 50.04,8.72 ; 46.35,5.03 45.66,5.03 ; 45.66,5.03 45.66,4.87 42.52,1.73 42.52,0.72 ; 45.66,5.03 R6.2
NET5: length 23.8
  Top Layer w0.508: C12.1 13.25,21.72 12.19,21.72 v1(11.05,20.57) 8.64,22.99 C13.2
  Bottom Layer w0.508: U1.6 11.05,16.26 v1(11.05,20.57) ; R8.2 8.25,2.94 H1.4
NET5R2: length 93.4
  Top Layer w0.508: 113.85,14.94 112.44,16.35 Q3.6 ; 113.85,14.94 115.5,13.29 ; 113.85,14.94 112.56,14.94 ; 110.66,14.94 108.63,16.97 Q3.3 ; 110.66,14.94 109.41,14.94 ; 110.66,14.94 112.56,14.94 ; 115.5,13.29 115.5,14.92 113.71,16.72 Q3.7 ; 115.5,13.29 115.5,9.84 R1.1 119.18,6.67 ; 112.56,14.94 111.17,16.34 Q3.5 ; 109.41,14.94 107.36,16.99 Q3.2 ; 109.41,14.94 U2.6 ; C6.1 101.83,22.05 100.77,22.05 v1(99.63,20.91) 97.21,23.32 C8.2
  Top Layer w2.032: R1.1 114.25,1.22 Q4.4 109.05,0.27 102.38,0.27 102.32,0.33 R2.2
  Bottom Layer w0.508: H2.4 96.83,3.28 R2.2 ; U2.6 99.63,16.59 v1(99.63,20.91)
NET5R3: length 93.4
  Top Layer w0.508: U3.6 65.15,14.81 ; 65.15,14.81 66.4,14.81 ; 65.15,14.81 63.1,16.86 Q5.2 ; 69.6,14.81 71.25,13.16 ; 69.6,14.81 68.31,14.81 ; 69.6,14.81 68.18,16.23 Q5.6 ; 71.25,13.16 71.25,9.71 R4.1 74.93,6.54 ; 71.25,13.16 71.25,14.8 69.45,16.59 Q5.7 ; Q5.3 64.37,16.84 66.4,14.81 ; 66.4,14.81 68.31,14.81 ; 68.31,14.81 66.91,16.21 Q5.5 ; C19.1 57.57,21.92 56.51,21.92 v1(55.37,20.78) 52.96,23.19 C20.2
  Top Layer w2.032: R4.1 70,1.1 Q6.4 64.8,0.14 58.13,0.14 58.06,0.21 R5.2
  Bottom Layer w0.508: v1(55.37,20.78) 55.37,16.46 U3.6 ; R5.2 52.58,3.15 H3.4
$1I136R1/$1N697: length 3
  Top Layer w1.016: 9.4,17.14 RHS.1
$1I136R1/$1N698: length 2.4
  Top Layer w1.016: RHS.2 17.03,17.14 17.51,17.63
$1I136R1/$1N699: length 3.1
  Top Layer w1.016: U1.5 12.25,12.06 12.46,11.86
$1I136R1/$1N700: length 12.9
  Top Layer w0.508: RLS.2 17.93,9.27 24,9.27 25.27,10.54 25.27,11.85 Q2.1
$1I136R1/$1N2292: length 11.3
  Top Layer w0.762: C7.1 1.78,20.51 U1.1 2.38,20.29 D1.2 2.53,23.11 C9.1
$1I136R1/$1N2600: length 15.3
  Top Layer w0.508: C13.1 6.67,23.11 D1.1 ; C13.1 6.79,23.71 9.21,26.12 C12.2 ; C13.1 6.79,22.29 U1.8
$1I136R2/$1N697: length 3
  Top Layer w1.016: U2.7 RHS1.1
$1I136R2/$1N698: length 2.4
  Top Layer w1.016: Q3.1 105.6,17.48 RHS1.2
$1I136R2/$1N699: length 3.2
  Top Layer w1.016: RLS1.1 100.83,12.4 U2.5
$1I136R2/$1N700: length 12.9
  Top Layer w0.508: RLS1.2 106.51,9.6 112.58,9.6 113.85,10.88 113.85,12.18 Q4.1
$1I136R2/$1N2292: length 11.3
  Top Layer w0.762: C4.1 91.1,23.45 D3.2 90.96,20.62 U2.1 90.35,20.84 88.58,22.62
$1I136R2/$1N2600: length 15.3
  Top Layer w0.508: C6.2 97.79,26.46 95.37,24.04 C8.1 ; C8.1 95.37,22.62 U2.8 ; C8.1 95.24,23.45 D3.1
$1I136R3/$1N697: length 3
  Top Layer w1.016: U3.7 RHS2.1
$1I136R3/$1N698: length 2.4
  Top Layer w1.016: Q5.1 61.35,17.35 RHS2.2
$1I136R3/$1N699: length 3.1
  Top Layer w1.016: U3.5 56.58,12.27 RLS2.1
$1I136R3/$1N700: length 12.9
  Top Layer w0.508: RLS2.2 62.25,9.48 68.33,9.48 69.6,10.75 69.6,12.05 Q6.1
$1I136R3/$1N2292: length 11.3
  Top Layer w0.762: 49.78,26.25 46.85,23.32 D5.2 46.71,20.5 U3.1 46.1,20.72 C16.1
$1I136R3/$1N2600: length 15.3
  Top Layer w0.508: C20.1 51.12,23.91 53.53,26.33 C19.2 ; C20.1 50.99,23.32 D5.1 ; C20.1 51.12,22.5 U3.8

## Text on the board
Top Silkscreen Layer: PhaseA | PhaseB | PhaseC

# Board PCB2
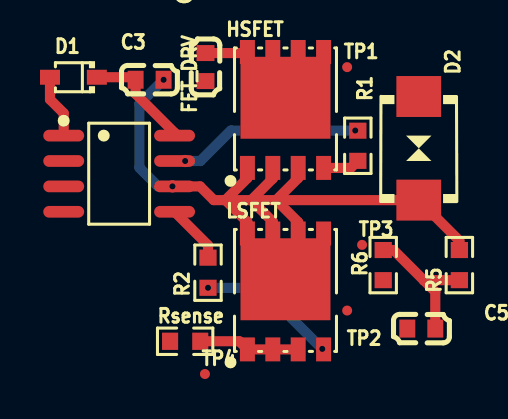
[diagram p4: board, top side]
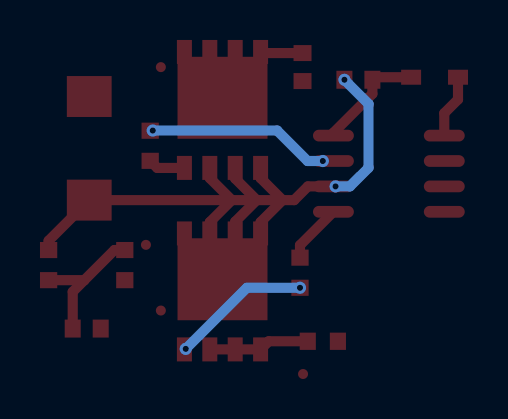
[diagram p5: board, bottom side, seen from below]

No outline. copper layers: Top Layer, Bottom Layer. Coordinates in mm from the lowest, leftmost part position.
Stack: Top Layer 0.035mm / Dielectric1 1.51mm FR4 er 4.5 / Bottom Layer 0.035mm

## Design rules (mm)
template: JLCPCB Capability(Two Layers Board)
spacing copperThickness1oz (default): track to track 0.102, other pairs 0.152 to 0.3
spacing copperThickness2oz: track to track 0.203, other pairs 0.152 to 0.3
track width copperThickness1oz (default): min 0.127, default 0.254, max 2.54
track width copperThickness2oz: min 0.203, default 0.254, max 2.54
differential pair differentialPair (default): width min 0.127, default 0.254, max 2.54; gap min 0.152, default 0.152
via viaSize (default): diameter min 0.5, default 0.61, max 10; hole min 0.3, default 0.305, max 6.3

## Placement (name value [footprint] x y rotation side)
C1  100nF  [C0603]  6.6 15.35 270 top
C3  100nF  [C0603]  3.81 14.72 0 top
C5  100nF  [C0603]  17.4 2.27 180 top
D1  1N5819WS  [SOD-323_L1.8-W1.3-LS2.5-RD]  0 14.85 180 top
D2  P6SMB6.8CA/TR13  [SMB_L4.6-W3.6-LS5.3-BI]  17.27 11.29 270 top
FET_DRV  IR2103STRPBF  [SOIC-8_L4.9-W3.9-P1.27-LS6.0-BL]  2.29 10.02 270 top
HSFET  SIR180DP-T1-RE3  [POWERPAK-SO-8_L5.9-W4.9-P1.27-LS6.2-BL]  10.61 13.21 0 top
LSFET  SIR180DP-T1-RE3  [powerpak-so-8_l5.9-w4.9-p1.27-ls6.2-bl]  10.61 4.13 0 top
R1  10  [R0603]  14.22 11.42 270 top
R2  10  [R0603]  6.73 5.07 270 top
R5  10K  [R0603]  19.3 5.45 90 top
R6  10K  [R0603]  15.49 5.45 90 top
Rsense  2mR  [R0603]  5.59 1.64 0 top
TP1  -  [Test-Point-0.5mm]  13.69 15.35 0 top
TP2  -  [Test-Point-0.5mm]  13.69 3.18 0 top
TP3  -  [Test-Point-0.5mm]  14.44 6.46 0 top
TP4  -  [Test-Point-0.5mm]  6.58 0 0 top

## Footprints (pads in the part's own frame, mm; a bottom-side part is the same pattern mirrored in y, then rotated)
C0603
  rect 0.8x0.9 smd: 1(-0.7,0) 2(0.7,0)
powerpak-so-8_l5.9-w4.9-p1.27-ls6.2-bl
  rect 0.75x1.2 smd: 1(-1.905,-2.9) 2(-0.635,-2.9) 3(0.635,-2.9) 4(1.905,-2.9) 5(1.905,2.9) 6(0.635,2.9) 7(-0.635,2.9) 8(-1.905,2.9)
  rect 4.5x4.1 smd: 8(0,0.609)
POWERPAK-SO-8_L5.9-W4.9-P1.27-LS6.2-BL
  rect 0.75x1.2 smd: 1(-1.905,-2.9) 2(-0.635,-2.9) 3(0.635,-2.9) 4(1.905,-2.9) 5(1.905,2.9) 6(0.635,2.9) 7(-0.635,2.9) 8(-1.905,2.9)
  rect 4.5x4.1 smd: 8(0,0.609)
R0603
  rect 0.806x0.864 smd: 1(-0.753,0) 2(0.753,0)
SMB_L4.6-W3.6-LS5.3-BI
  rect 2.047x2.241 smd: 1(-2.591,0) 2(2.591,0)
SOD-323_L1.8-W1.3-LS2.5-RD
  rect 1x0.75 smd: 1(-1.173,0) 2(1.173,0)
SOIC-8_L4.9-W3.9-P1.27-LS6.0-BL
  oval 0.588x2.045 smd: 1(-1.905,-2.772) 2(-0.635,-2.772) 3(0.635,-2.772) 4(1.905,-2.772) 5(1.905,2.772) 6(0.635,2.772) 7(-0.635,2.772) 8(-1.905,2.772)
Test-Point-0.5mm
  round 0.5 smd: 1(0,0)

## Nets
As in the schematic.

## Via types
v1: diameter 0.61, hole 0.305, Top Layer to Bottom Layer, 6 vias

## Routing (per net, layer and track width the routed paths; a pad name or vN(x,y) marks a point on that pad's centre or on a via; arc(x,y) is an arc through that point)
VCC: length 2.1
  Top Layer w0.508: C1.1 8.65,16.05 HSFET.8
NET4: length 7.1
  Top Layer w0.508: 17.53,4.69 18.1,4.11 C5.1 ; 17.53,4.69 17.53,4.69 R5.1 ; 17.53,4.69 16.01,6.2 R6.2
PHASE_OUT: length 35.4
  Top Layer w0.508: 7.6,8.7 8.7,9.8 HSFET.1 ; 7.6,8.7 8.7,7.6 LSFET.8 ; 7.6,8.7 8.89,8.7 ; 7.6,8.7 7.02,8.7 6.34,9.38 FET_DRV.6 v1(4.95,9.38) ; 8.89,8.7 9.97,9.78 HSFET.2 ; 8.89,8.7 9.97,7.62 LSFET.7 ; 8.89,8.7 10.14,8.7 ; 10.14,8.7 11.24,9.8 HSFET.3 ; 10.14,8.7 D2.2 19.3,6.67 R5.2 ; 10.14,8.7 11.24,7.6 LSFET.6
  Bottom Layer w0.508: v1(4.51,14.72) 3.3,13.51 3.3,10.32 4.23,9.38 v1(4.95,9.38)
VPA_RSP: length 5.1
  Top Layer w0.508: LSFET.3 LSFET.2 LSFET.1 8.29,1.64 Rsense.2
$1N508: length 9.3
  Top Layer w0.254: R1.1 14.22,12.18 v1(14.1,12.18)
  Bottom Layer w0.508: v1(5.59,10.66) 6.35,10.66 7.87,12.18 v1(14.1,12.18)
$1N509: length 1.9
  Top Layer w0.508: HSFET.4 13.87,10.31 R1.2
$1N510: length 3
  Top Layer w0.508: R2.1 6.73,6.44 FET_DRV.5
$1N511: length 7.1
  Top Layer w0.508: LSFET.4 12.49,1.26 v1(12.45,1.26)
  Bottom Layer w0.508: v1(6.73,4.31) 9.39,4.31 v1(12.45,1.26)
$1N519: length 3.2
  Top Layer w0.508: D1.2 -1.17,13.73 -0.49,13.05 FET_DRV.1
$1N521: length 5.6
  Top Layer w0.508: D1.1 2.98,14.85 C3.1 3.11,14.01 5.06,12.07 FET_DRV.8

# Board PCB3
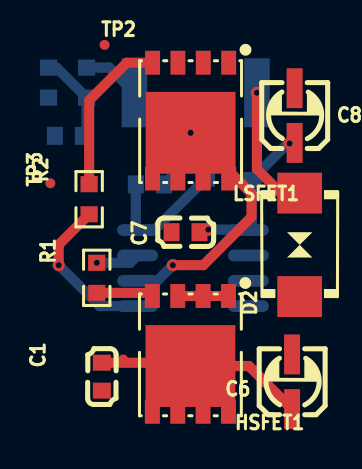
[diagram p6: board, top side]
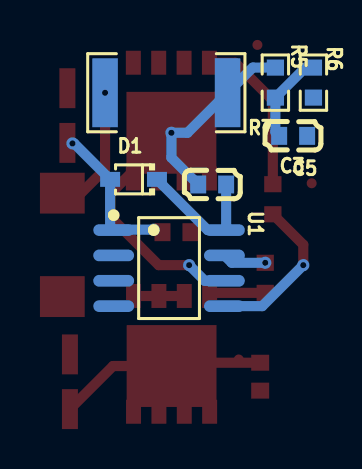
[diagram p7: board, bottom side, seen from below]

No outline. copper layers: Top Layer, Bottom Layer. Coordinates in mm from the lowest, leftmost part position.
Stack: Top Layer 0.035mm / Dielectric1 1.51mm FR4 er 4.5 / Bottom Layer 0.035mm

## Design rules (mm)
template: JLCPCB Capability(Two Layers Board)
spacing copperThickness1oz (default): track to track 0.102, other pairs 0.152 to 0.3
spacing copperThickness2oz: track to track 0.203, other pairs 0.152 to 0.3
track width copperThickness1oz (default): min 0.127, default 0.254, max 2.54
track width copperThickness2oz: min 0.203, default 0.254, max 2.54
differential pair differentialPair (default): width min 0.127, default 0.254, max 2.54; gap min 0.152, default 0.152
via viaSize (default): diameter min 0.5, default 0.61, max 10; hole min 0.3, default 0.305, max 6.3

## Placement (name value [footprint] x y rotation side)
C1  100nF  [C0603]  2.67 0.25 270 top
C3  100nF  [C0603]  5.07 9.88 0 bottom
C5  100nF  [C0603]  1.02 12.32 180 bottom
C6  10uF  [CAP-SMD_BD3.0-L3.3-W3.3-RD]  12.19 0 270 top
C7  100nF  [C0603]  6.86 7.49 180 top
C8  10uF  [CAP-SMD_BD3.0-L3.3-W3.3-RD]  12.32 13.33 270 top
D1  1N5819WS  [SOD-323_L1.8-W1.3-LS2.5-RD]  9.01 10.14 0 bottom
D2  P6SMB6.8CA/TR13  [SMB_L4.6-W3.6-LS5.3-BI]  12.57 6.86 90 top
HSFET1  SIR180DP-T1-RE3  [POWERPAK-SO-8_L5.9-W4.9-P1.27-LS6.2-BL]  7.1 1.4 180 top
LSFET1  SIR180DP-T1-RE3  [POWERPAK-SO-8_L5.9-W4.9-P1.27-LS6.2-BL]  7.11 13.08 180 top
R1  50  [R0603]  2.41 5.21 270 top
R2  50  [R0603]  2.03 9.14 90 top
R5  10K  [R0603]  1.91 14.99 90 bottom
R6  10K  [R0603]  0 14.99 90 bottom
R7  5mΩ  [R2512]  7.37 14.48 0 bottom
TP1  -  [Test-Point-0.5mm]  3.74 1.12 180 top
TP2  -  [Test-Point-0.5mm]  2.8 16.87 0 top
TP3  -  [Test-Point-0.5mm]  0.09 9.94 90 top
U1  IR2104STRPBF  [SOIC-8_L4.9-W3.9-P1.27-LS6.0-BL]  7.23 5.69 270 bottom

## Footprints (pads in the part's own frame, mm; a bottom-side part is the same pattern mirrored in y, then rotated)
C0603
  rect 0.8x0.9 smd: 1(-0.7,0) 2(0.7,0)
CAP-SMD_BD3.0-L3.3-W3.3-RD
  rect 2x0.8 smd: 1(1.37,0) 2(-1.37,0)
POWERPAK-SO-8_L5.9-W4.9-P1.27-LS6.2-BL
  rect 0.75x1.2 smd: 1(-1.905,-2.9) 2(-0.635,-2.9) 3(0.635,-2.9) 4(1.905,-2.9) 5(1.905,2.9) 6(0.635,2.9) 7(-0.635,2.9) 8(-1.905,2.9)
  rect 4.5x4.1 smd: 8(0,0.609)
R0603
  rect 0.806x0.864 smd: 1(-0.753,0) 2(0.753,0)
R2512
  rect 1.282x3.456 smd: 1(-3.067,0) 2(3.067,0)
SMB_L4.6-W3.6-LS5.3-BI
  rect 2.047x2.241 smd: 1(-2.591,0) 2(2.591,0)
SOD-323_L1.8-W1.3-LS2.5-RD
  rect 1x0.75 smd: 1(-1.173,0) 2(1.173,0)
SOIC-8_L4.9-W3.9-P1.27-LS6.0-BL
  oval 0.588x2.045 smd: 1(-1.905,-2.772) 2(-0.635,-2.772) 3(0.635,-2.772) 4(1.905,-2.772) 5(1.905,2.772) 6(0.635,2.772) 7(-0.635,2.772) 8(-1.905,2.772)
Test-Point-0.5mm
  round 0.5 smd: 1(0,0)

## Nets
As in the schematic, except:
ISENSE: C3.2 HSFET1.1 HSFET1.2 HSFET1.3 LSFET1.5 LSFET1.6 LSFET1.7 LSFET1.8 R5.2 R7.1 TP2.1 U1.6
VSENSE: C5.1 R5.1 R6.2 TP3.1

## Via types
v1: diameter 0.61, hole 0.305, Top Layer to Bottom Layer, 7 vias

## Routing (per net, layer and track width the routed paths; a pad name or vN(x,y) marks a point on that pad's centre or on a via; arc(x,y) is an arc through that point)
VCC: length 10.5
  Top Layer w0.508: C1.1 6.94,0.95 HSFET1.8 10.03,0.79 C6.1
ISENSE: length 24.8
  Top Layer w0.508: HSFET1.3 HSFET1.1 ; v1(7.11,12.47) 10.16,9.42 10.16,8.25 7.75,5.84 v1(6.22,5.84)
  Bottom Layer w0.508: U1.6 5.44,5.06 v1(6.22,5.84) ; C3.2 7.11,11.23 v1(7.11,12.47) 6.31,12.47 R7.1 3.04,15.74 R5.2
PHASE_OUT: length 6.9
  Top Layer w0.508: D2.2 12.1,8.98 10.43,10.65 v1(10.43,14.48)
VSENSE: length 4.5
  Bottom Layer w0.508: C5.1 1.91,12.51 R5.1 0.4,15.74 R6.2
$1N697: length 2.2
  Bottom Layer w0.508: v1(2.41,5.96) 4.09,5.96 U1.7
$1N698: length 2.8
  Top Layer w0.508: HSFET1.4 5.04,4.45 R1.2
$1N699: length 8
  Top Layer w0.508: v1(0.51,5.84) 0.51,6.87 R2.1
  Bottom Layer w0.508: U1.5 2.56,3.79 v1(0.51,5.84)
$1N700: length 8.2
  Top Layer w0.508: LSFET1.4 3.92,15.98 2.03,14.1 R2.2
$1N719: length 6.8
  Bottom Layer w0.508: C3.1 4.37,7.69 U1.8 5.29,7.6 D1.1
$1N721: length 8
  Top Layer w0.508: v1(12.06,11.94) 12.09,11.96 C8.1 ; C7.1 7.69,7.62 v1(8,7.62)
  Bottom Layer w0.508: v1(12.06,11.94) 11.98,11.94 D1.2 10.18,7.78 U1.1 9.98,7.62 v1(8,7.62)

# Board PCB4
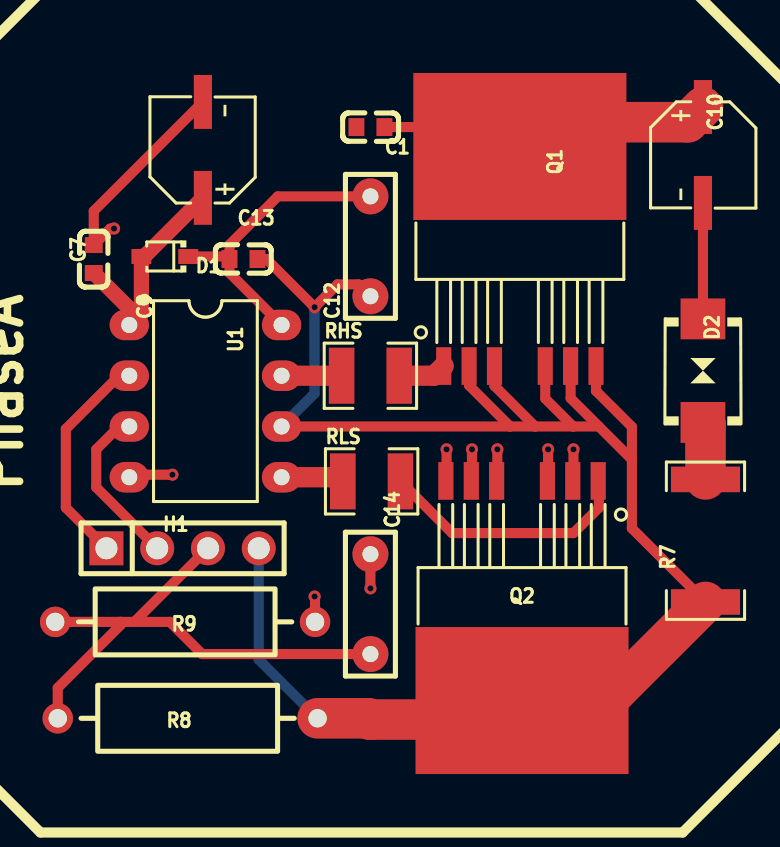
[diagram p8: board, top side]
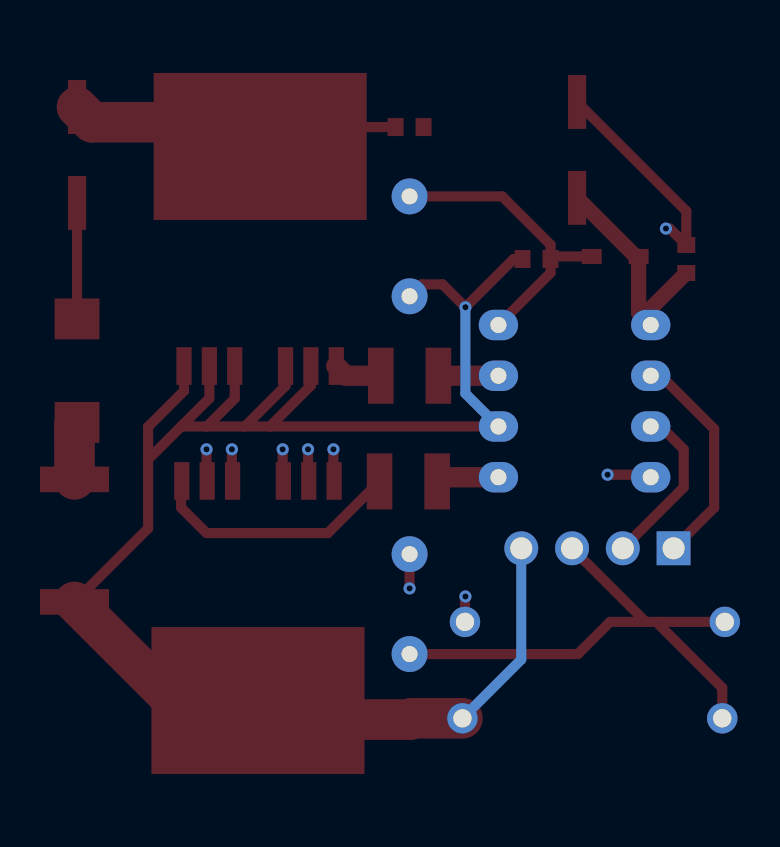
[diagram p9: board, bottom side, seen from below]

No outline. copper layers: Top Layer, Bottom Layer. Coordinates in mm from the lowest, leftmost part position.
Stack: Top Layer 0.035mm / Dielectric1 1.51mm FR4 er 4.5 / Bottom Layer 0.035mm

## Design rules (mm)
template: JLCPCB Capability(Two Layers Board)
spacing copperThickness1oz (default): track to track 0.102, other pairs 0.152 to 0.3
spacing copperThickness2oz: track to track 0.203, other pairs 0.152 to 0.3
track width copperThickness1oz (default): min 0.127, default 0.254, max 2.54
track width copperThickness2oz: min 0.203, default 0.254, max 2.54
differential pair differentialPair (default): width min 0.127, default 0.254, max 2.54; gap min 0.152, default 0.152
via viaSize (default): diameter min 0.5, default 0.61, max 10; hole min 0.3, default 0.305, max 6.3

## Placement (name value [footprint] x y rotation side)
C1  100nF  [C0603]  13.84 29.59 180 top
C7  100nF  [C0603]  0 22.99 90 top
C9  10uF  [CAP-SMD_BD5.0-L5.3-W5.3-LS6.3-FD]  5.46 28.45 90 top
C10  10uF  [CAP-SMD_BD5.0-L5.3-W5.3-LS6.3-FD]  30.48 28.19 270 top
C12  1uF  [CAP-TH_L7.2-W2.5-P5.00-D0.6]  13.84 23.62 90 top
C13  100nF  [C0603]  7.49 22.99 0 top
C14  1uF  [CAP-TH_L7.2-W2.5-P5.00-D0.6]  13.84 5.72 270 top
D1  1N5819WS  [SOD-323_L1.8-W1.3-LS2.5-RD]  3.56 23.11 180 top
D2  P6SMB6.8CA/TR13  [SMB_L4.6-W3.6-LS5.3-BI]  30.48 17.4 270 top
H1  -  [HDR-TH_4P-P2.54-V-M]  4.44 8.51 0 top
Q1  IRF2804STRL7PP  [D2PAK-7_L10.6-W9.6-P1.27-LS15.9-BR]  21.32 23.12 270 top
Q2  IRF2804STRL7PP  [D2PAK-7_L10.6-W9.6-P1.27-LS15.9-BR]  21.43 6.38 90 top
R7  5mΩ  [R2512]  30.61 8.89 90 top
R8  10kΩ  [RES-TH_BD3.3-L9.0-P13.00-D0.6]  4.7 0 0 top
R9  10kΩ  [RES-TH_BD3.3-L9.0-P13.00-D0.6]  4.57 4.83 180 top
RHS  10  [R1210]  13.84 17.14 0 top
RLS  10  [R1210]  13.9 11.86 0 top
U1  IR2104PBF  [DIP-8_L9.9-W6.6-P2.54-LS7.62-BL]  5.59 15.88 270 top

## Footprints (pads in the part's own frame, mm; a bottom-side part is the same pattern mirrored in y, then rotated)
C0603
  rect 0.8x0.9 smd: 1(-0.7,0) 2(0.7,0)
CAP-SMD_BD5.0-L5.3-W5.3-LS6.3-FD
  rect 2.7x0.91 smd: 1(-2.4,0) 2(2.4,0)
CAP-TH_L7.2-W2.5-P5.00-D0.6
  round 1.8 hole 0.8: 1(-2.499,0) 2(2.499,0)
D2PAK-7_L10.6-W9.6-P1.27-LS15.9-BR
  rect 1.887x0.762 smd: 1(5.495,-3.81) 2(5.495,-2.54) 3(5.495,-1.27) 5(5.495,1.27) 6(5.495,2.54) 7(5.495,3.81)
  rect 7.356x10.66 smd: 4(-5.495,0)
DIP-8_L9.9-W6.6-P2.54-LS7.62-BL
  oval 1.524x1.97 hole 0.8: 1(-3.81,-3.81) 2(-1.27,-3.81) 3(1.27,-3.81) 4(3.81,-3.81) 5(3.81,3.81) 6(1.27,3.81) 7(-1.27,3.81) 8(-3.81,3.81)
HDR-TH_4P-P2.54-V-M
  rect 1.7x1.7 hole 1.1: 1(-3.81,0)
  round 1.7 hole 1.1: 2(-1.27,0) 3(1.27,0) 4(3.81,0)
R1210
  rect 1.282x2.808 smd: 1(-1.441,0) 2(1.441,0)
R2512
  rect 1.282x3.456 smd: 1(-3.067,0) 2(3.067,0)
RES-TH_BD3.3-L9.0-P13.00-D0.6
  round 1.524 hole 0.914: 1(-6.5,0) 2(6.5,0)
SMB_L4.6-W3.6-LS5.3-BI
  rect 2.047x2.241 smd: 1(-2.591,0) 2(2.591,0)
SOD-323_L1.8-W1.3-LS2.5-RD
  rect 1x0.75 smd: 1(-1.173,0) 2(1.173,0)

## Nets
GND: C1.2 C7.2 C9.2 C10.2 C14.1 D2.1 Q2.2 Q2.3 Q2.5 Q2.6 Q2.7 R9.1 U1.4
VCC: C1.1 C10.1 Q1.4
HI_IN: H1.1 U1.2
ISENSE: C12.1 C13.2 H1.4 Q1.2 Q1.3 Q1.5 Q1.6 Q1.7 Q2.4 R7.1 R8.2 U1.6
PHASE_OUT: D2.2 R7.2
SD#: H1.2 U1.3
VSENSE: C14.2 H1.3 R8.1 R9.2
$1N697: RHS.1 U1.7
$1N698: Q1.1 RHS.2
$1N699: RLS.1 U1.5
$1N700: Q2.1 RLS.2
$1N2292: C7.1 C9.1 D1.2 U1.1
$1N2600: C12.2 C13.1 D1.1 U1.8

## Via types
v1: diameter 0.61, hole 0.305, Top Layer to Bottom Layer, 10 vias

## Routing (per net, layer and track width the routed paths; a pad name or vN(x,y) marks a point on that pad's centre or on a via; arc(x,y) is an arc through that point)
GND: length 30.1
  Top Layer w0.508: v1(18.92,13.46) 18.92,11.92 Q2.6 ; v1(24,13.46) 24,11.92 Q2.2 ; v1(3.94,12.19) 1.91,12.19 U1.4 ; v1(11.05,6.1) 11.07,6.07 R9.1 ; v1(1.02,24.51) 0.82,24.51 C7.2 0,25.39 C9.2 ; v1(22.73,13.46) 22.73,11.92 Q2.3 ; Q2.5 20.19,11.92 v1(20.19,13.46) ; v1(13.84,6.5) C14.1 ; D2.1 30.48,26.17 ; Q2.7 17.65,11.92 v1(17.65,13.46)
VCC: length 17.2
  Top Layer w0.508: C1.1 20.35,29.59 Q1.4
  Top Layer w2.032: Q1.4 22.53,29.83 29.72,29.83 C10.1
HI_IN: length 11.1
  Top Layer w0.508: H1.1 -1.4,10.54 -1.4,14.48 1.27,17.14 U1.2
ISENSE: length 93.4
  Top Layer w0.508: 25.27,14.61 26.92,12.95 ; 25.27,14.61 23.99,14.61 ; 25.27,14.61 23.86,16.02 Q1.6 ; 26.92,12.95 26.92,14.59 25.13,16.38 Q1.7 ; 26.92,12.95 26.92,9.51 R7.1 30.61,6.33 ; Q1.3 20.05,16.64 22.08,14.61 ; 20.83,14.61 18.78,16.66 Q1.2 ; 20.83,14.61 22.08,14.61 ; 20.83,14.61 U1.6 ; 23.99,14.61 22.59,16 Q1.5 ; 23.99,14.61 22.08,14.61 ; C13.2 8.64,22.99 v1(11.05,20.57) 12.19,21.72 13.25,21.72 C12.1
  Top Layer w2.032: R8.2 13.74,0 13.8,-0.06 20.48,-0.06 Q2.4 25.67,0.89 R7.1
  Bottom Layer w0.508: v1(11.05,20.57) 11.05,16.26 U1.6 ; R8.2 8.25,2.94 H1.4
PHASE_OUT: length 2.9
  Top Layer w2.032: D2.2 30.61,14.68 R7.2
SD#: length 8.3
  Top Layer w0.508: U1.3 1.27,14.61 0.13,13.46 0.13,11.56 H1.2
VSENSE: length 27.3
  Top Layer w0.508: 2.03,4.83 1.34,4.83 ; 2.03,4.83 H1.3 ; 2.03,4.83 3.81,4.83 5.42,3.22 C14.2 ; 1.34,4.83 R9.2 ; 1.34,4.83 1.34,4.66 -1.8,1.52 -1.8,0.51
$1N697: length 3
  Top Layer w1.016: U1.7 RHS.1
$1N698: length 2.4
  Top Layer w1.016: RHS.2 17.03,17.14 Q1.1
$1N699: length 3.1
  Top Layer w1.016: U1.5 12.25,12.06 RLS.1
$1N700: length 12.9
  Top Layer w0.508: RLS.2 17.93,9.27 24,9.27 25.27,10.54 25.27,11.85 Q2.1
$1N2292: length 11.3
  Top Layer w0.762: C7.1 1.78,20.51 U1.1 2.38,20.29 D1.2 2.53,23.11 C9.1
$1N2600: length 15.3
  Top Layer w0.508: C13.1 6.67,23.11 D1.1 ; C13.1 6.79,22.29 U1.8 ; C13.1 6.79,23.71 9.21,26.12 C12.2

## Text on the board
Top Silkscreen Layer: PhaseA
